# Altium schematic sheet LineCliffSensors.SchDoc
size A
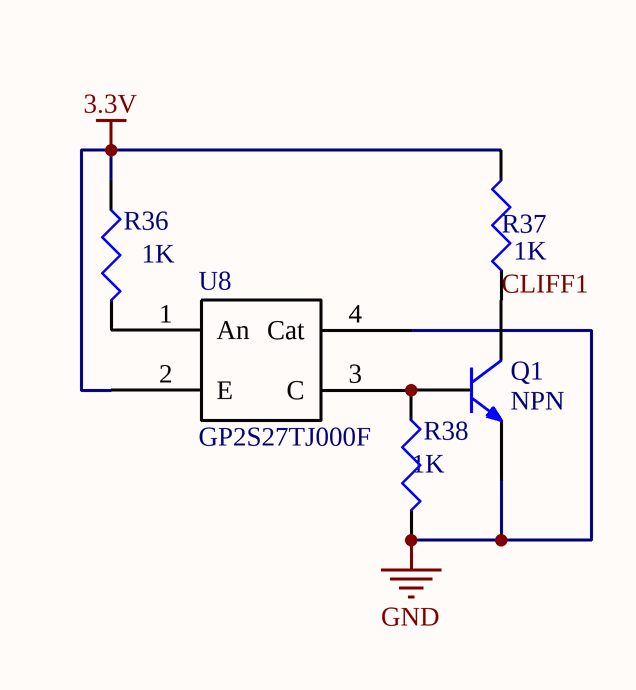
[diagram p0: LineCliffSensors.SchDoc]

## Parts
Q1  NPN  [SOT-23]
R36  value 1K  [RESC1608L]  (hidden comment: Res3)
R37  value 1K  [RESC1608L]  (hidden comment: Res3)
R38  value 1K  [RESC1608L]  (hidden comment: Res3)
U8  GP2S27TJ000F  [GP2S27J0000F]

## Nets
3.3V: R36.1 R37.2 U8.2(E)
GND: Q1.2(E) R38.2 U8.4(Cat)
CLIFF1: Q1.3(C) R37.1
NetQ1_1: Q1.1(B) R38.1 U8.3(C)
NetR36_2: R36.2 U8.1(An)

## Library data of the parts
R36-R38 = Res3: Resistor; Published: 8-Jun-2000; LatestRevisionDate: 29-May-2009; LatestRevisionNote: IPC-7351 Footprint Added.; PackageReference: J1-0603; Publisher: Altium Limited; PackageDescription: Chip Resistor